# EAGLE schematic Brundage Business Card - REV 2.0 (EAGLE 9.5.2)
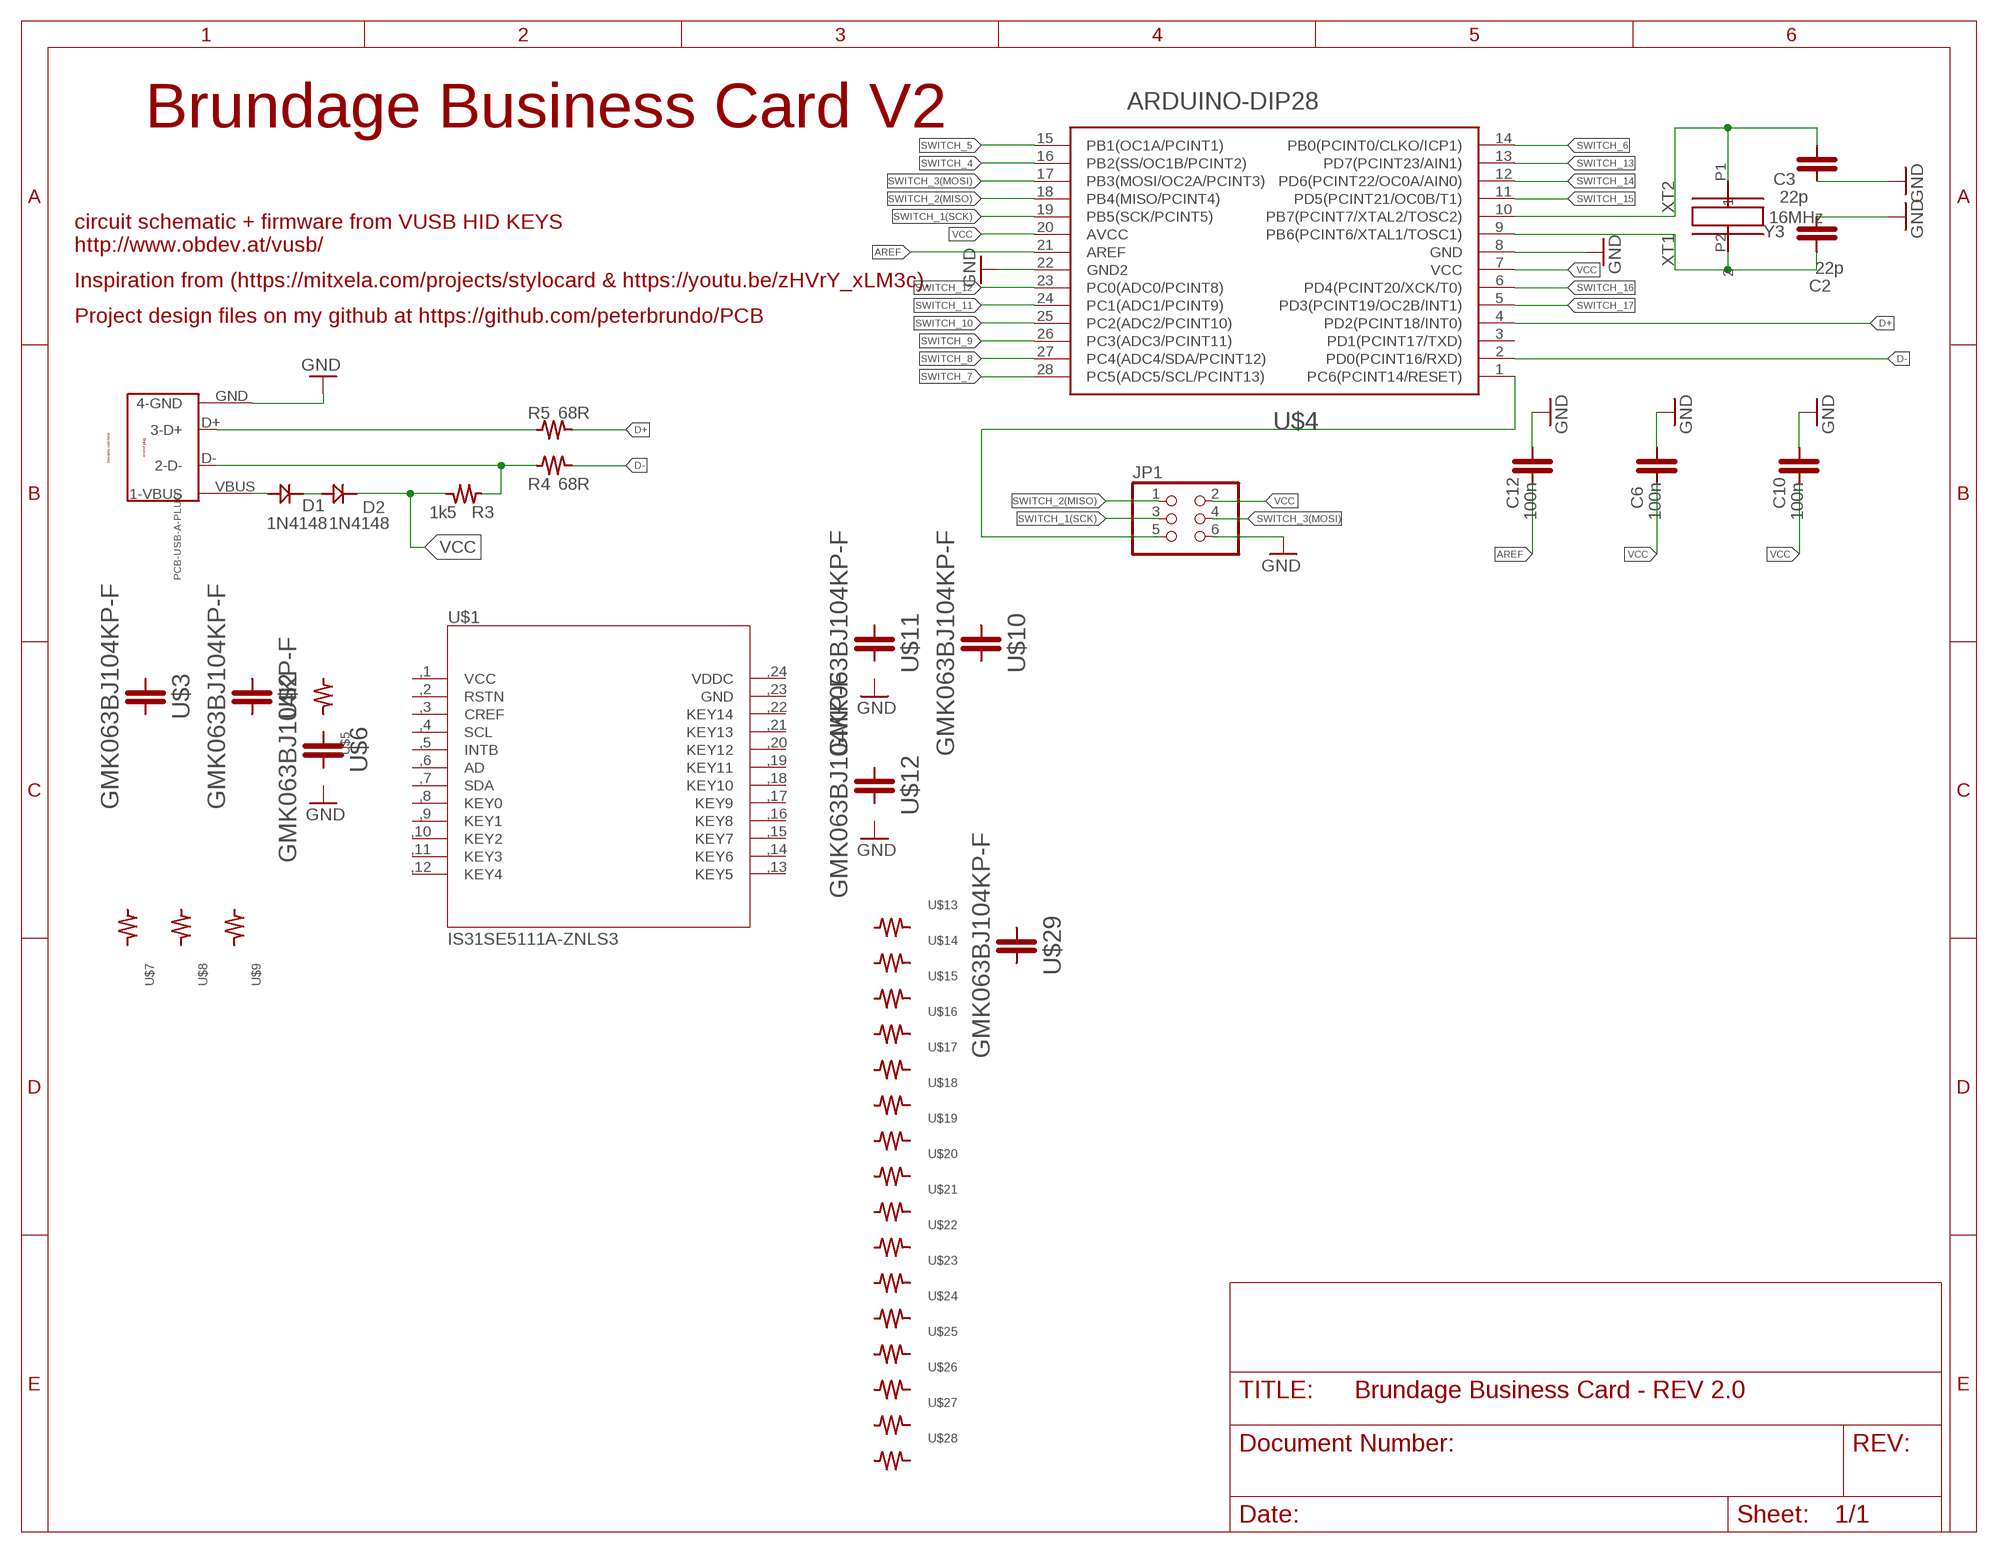
[diagram p0: schematic, sheet 1]

## Parts
C2  22p  GRM0225C1E220GA02L  [GRM0225C1E220GA02L]
C3  22p  GRM0225C1E220GA02L  [GRM0225C1E220GA02L]
C6  100n  GMK063BJ104KP-F  [GMK063BJ104KP-F]
C10  100n  GMK063BJ104KP-F  [GMK063BJ104KP-F]
C12  100n  GMK063BJ104KP-F  [GMK063BJ104KP-F]
D1  1N4148  [1N4148]
D2  1N4148  [1N4148]
JP1  PINHD-2X3  [2X03]
PCB-USB-A-PLUG  PCB/USB-SERIES"A"PLUG  [USB-SERIES-A-PLUG]
R3  1k5  CRCW06031K50FKEAC  [CRCW06031K50FKEAC]
R4  68R  RCS060368R0FKEA  [RCS060368R0FKEA]
R5  68R  RCS060368R0FKEA  [RCS060368R0FKEA]
U$1  IS31SE5111A-ZNLS3  [LUMISSIL-TSSOP-24]
U$2  GMK063BJ104KP-F  [GMK063BJ104KP-F]
U$3  GMK063BJ104KP-F  [GMK063BJ104KP-F]
U$4  ARDUINO-DIP28  [DIL28-3]
U$5  CRCW06031K50FKEAC  [CRCW06031K50FKEAC]
U$6  GMK063BJ104KP-F  [GMK063BJ104KP-F]
U$7  CRCW06031K50FKEAC  [CRCW06031K50FKEAC]
U$8  CRCW06031K50FKEAC  [CRCW06031K50FKEAC]
U$9  CRCW06031K50FKEAC  [CRCW06031K50FKEAC]
U$10  GMK063BJ104KP-F  [GMK063BJ104KP-F]
U$11  GMK063BJ104KP-F  [GMK063BJ104KP-F]
U$12  GMK063BJ104KP-F  [GMK063BJ104KP-F]
U$13  CRCW06031K50FKEAC  [CRCW06031K50FKEAC]
U$14  CRCW06031K50FKEAC  [CRCW06031K50FKEAC]
U$15  CRCW06031K50FKEAC  [CRCW06031K50FKEAC]
U$16  CRCW06031K50FKEAC  [CRCW06031K50FKEAC]
U$17  CRCW06031K50FKEAC  [CRCW06031K50FKEAC]
U$18  CRCW06031K50FKEAC  [CRCW06031K50FKEAC]
U$19  CRCW06031K50FKEAC  [CRCW06031K50FKEAC]
U$20  CRCW06031K50FKEAC  [CRCW06031K50FKEAC]
U$21  CRCW06031K50FKEAC  [CRCW06031K50FKEAC]
U$22  CRCW06031K50FKEAC  [CRCW06031K50FKEAC]
U$23  CRCW06031K50FKEAC  [CRCW06031K50FKEAC]
U$24  CRCW06031K50FKEAC  [CRCW06031K50FKEAC]
U$25  CRCW06031K50FKEAC  [CRCW06031K50FKEAC]
U$26  CRCW06031K50FKEAC  [CRCW06031K50FKEAC]
U$27  CRCW06031K50FKEAC  [CRCW06031K50FKEAC]
U$28  CRCW06031K50FKEAC  [CRCW06031K50FKEAC]
U$29  GMK063BJ104KP-F  [GMK063BJ104KP-F]
Y3  16MHz  ABL-8.000MHZ-B2  [ABL-8.000MHZ-B2]

## Nets
AREF [aref]: C12.P2 U$4.21(AREF)
D+: R5.P2 U$4.4(PD2(PCINT18/INT0))
D-: R4.P2 U$4.2(PD0(PCINT16/RXD))
GND [gnd]: C2.P2 C3.P2 C6.P1 C10.P1 C12.P1 JP1.6 PCB-USB-A-PLUG.GND(4-GND) U$4.8(GND) U$4.22(GND2)
N$25: PCB-USB-A-PLUG.D+(3-D+) R5.P1
N$27 [usbvcc]: PCB-USB-A-PLUG.D-(2-D-) R3.P1 R4.P1
N$28 [usbvcc]: D1.ANODE(+) PCB-USB-A-PLUG.VBUS(1-VBUS)
N$29 [usbvcc]: D1.CATHODE(-) D2.ANODE(+)
N$52: JP1.5 U$4.1(PC6(PCINT14/RESET))
SWITCH_1(SCK): JP1.3 U$4.19(PB5(SCK/PCINT5))
SWITCH_2(MISO): JP1.1 U$4.18(PB4(MISO/PCINT4))
SWITCH_3(MOSI): JP1.4 U$4.17(PB3(MOSI/OC2A/PCINT3))
SWITCH_4: U$4.16(PB2(SS/OC1B/PCINT2))
SWITCH_5: U$4.15(PB1(OC1A/PCINT1))
SWITCH_6: U$4.14(PB0(PCINT0/CLKO/ICP1))
SWITCH_7: U$4.28(PC5(ADC5/SCL/PCINT13))
SWITCH_8: U$4.27(PC4(ADC4/SDA/PCINT12))
SWITCH_9: U$4.26(PC3(ADC3/PCINT11))
SWITCH_10: U$4.25(PC2(ADC2/PCINT10))
SWITCH_11: U$4.24(PC1(ADC1/PCINT9))
SWITCH_12: U$4.23(PC0(ADC0/PCINT8))
SWITCH_13: U$4.13(PD7(PCINT23/AIN1))
SWITCH_14: U$4.12(PD6(PCINT22/OC0A/AIN0))
SWITCH_15: U$4.11(PD5(PCINT21/OC0B/T1))
SWITCH_16: U$4.6(PD4(PCINT20/XCK/T0))
SWITCH_17: U$4.5(PD3(PCINT19/OC2B/INT1))
VCC [usbvcc]: C6.P2 C10.P2 D2.CATHODE(-) JP1.2 R3.P2 U$4.7(VCC) U$4.20(AVCC)
XT1: C2.P1 U$4.9(PB6(PCINT6/XTAL1/TOSC1)) Y3.P2
XT2: C3.P1 U$4.10(PB7(PCINT7/XTAL2/TOSC2)) Y3.P1
Unconnected: U$1.,1(VCC) U$1.,2(RSTN) U$1.,3(CREF) U$1.,4(SCL) U$1.,5(INTB) U$1.,6(AD) U$1.,7(SDA) U$1.,8(KEY0) U$1.,9(KEY1) U$1.,10(KEY2) U$1.,11(KEY3) U$1.,12(KEY4) U$1.,13(KEY5) U$1.,14(KEY6) U$1.,15(KEY7) U$1.,16(KEY8) U$1.,17(KEY9) U$1.,18(KEY10) U$1.,19(KEY11) U$1.,20(KEY12) U$1.,21(KEY13) U$1.,22(KEY14) U$1.,23(GND) U$1.,24(VDDC) U$2.P1 U$2.P2 U$3.P1 U$3.P2 U$4.3(PD1(PCINT17/TXD)) U$5.P1 U$5.P2 U$6.P1 U$6.P2 U$7.P1 U$7.P2 U$8.P1 U$8.P2 U$9.P1 U$9.P2 U$10.P1 U$10.P2 U$11.P1 U$11.P2 U$12.P1 U$12.P2 U$13.P1 U$13.P2 U$14.P1 U$14.P2 U$15.P1 U$15.P2 U$16.P1 U$16.P2 U$17.P1 U$17.P2 U$18.P1 U$18.P2 U$19.P1 U$19.P2 U$20.P1 U$20.P2 U$21.P1 U$21.P2 U$22.P1 U$22.P2 U$23.P1 U$23.P2 U$24.P1 U$24.P2 U$25.P1 U$25.P2 U$26.P1 U$26.P2 U$27.P1 U$27.P2 U$28.P1 U$28.P2 U$29.P1 U$29.P2

## Notes on the sheet
- Brundage Business Card V2
- circuit schematic + firmware from VUSB HID KEYS 
  http://www.obdev.at/vusb/
- Inspiration from (https://mitxela.com/projects/stylocard & https://youtu.be/zHVrY_xLM3c).
- Project design files on my github at https://github.com/peterbrundo/PCB

## Library data of the parts
C2 C3 = Brundage Buisness Card:GRM0225C1E220GA02L
C6 C10 C12 U$2 U$3 U$6 U$10-U$12 U$29 = Brundage Buisness Card:GMK063BJ104KP-F
D1 D2 = Brundage Buisness Card:1N4148
JP1 = pinhead:PINHD-2X3: PIN HEADER
PCB-USB-A-PLUG = Brundage Buisness Card:PCB/USB-SERIES"A"PLUG
R3 U$5 U$7-U$9 U$13-U$28 = Brundage Buisness Card:CRCW06031K50FKEAC
R4 R5 = Brundage Buisness Card:RCS060368R0FKEA
U$1 = Brundage Buisness Card:IS31SE5111A-ZNLS3
U$4 = Brundage Buisness Card:ARDUINO-DIP28
Y3 = Brundage Buisness Card:ABL-8.000MHZ-B2

## Net classes
0 default: clearance 0.152 mm
2 gnd: width 0.025 mm, drill 0.559 mm, clearance 0.152 mm to class 0, clearance 0.152 mm
3 usbvcc: width 0.025 mm, drill 0.61 mm, clearance 0.152 mm to class 0, clearance 0.254 mm
4 aref: width 0.025 mm, drill 0.61 mm, clearance 0.152 mm to class 0, clearance 0.254 mm
6 lol text: clearance 0.152 mm to class 0, clearance 0.127 mm